# EAGLE design moduloSensores (EAGLE 7.6.0)
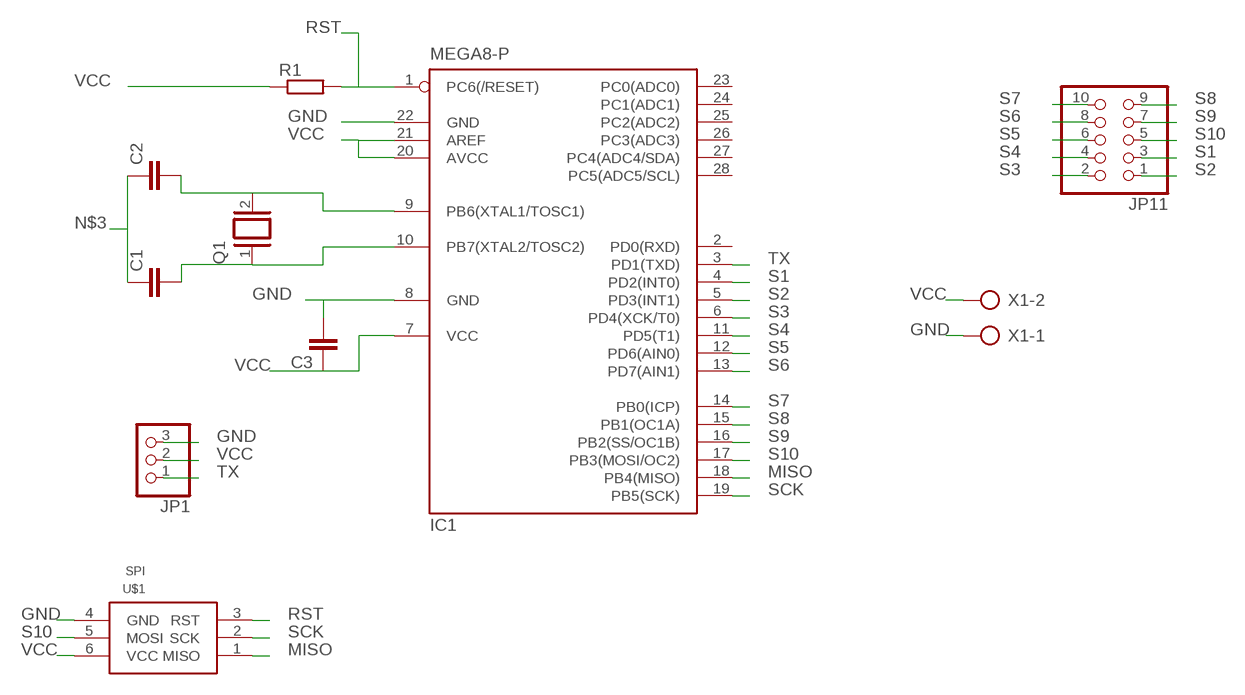
[diagram p0: schematic, sheet 1]

## Parts
C1  C-EU050-025X075  [C050-025X075]
C2  C-EU050-025X075  [C050-025X075]
C3  C-EU050-025X075  [C050-025X075]
IC1  MEGA8-P  [DIL28-3]
JP1  PINHD-1X3  [1X03]
JP11  PINHD-2X5  [2X05]
Q1  XTAL/S  [QS]
R1  R-EU_0204/7  [0204/7]
U$1  SPI  [HEAD-2X3]
X1  AK500/2  [AK500/2]

## Nets
GND: C3.2 IC1.8(GND) IC1.22(GND) JP1.3 U$1.4(GND) X1.1
MISO: IC1.18(PB4(MISO)) U$1.1(MISO)
N$1: C2.2 IC1.9(PB6(XTAL1/TOSC1)) Q1.2
N$2: C1.2 IC1.10(PB7(XTAL2/TOSC2)) Q1.1
N$3: C1.1 C2.1
RST: IC1.1(PC6(/RESET)) R1.2 U$1.3(RST)
S1: IC1.4(PD2(INT0)) JP11.3
S2: IC1.5(PD3(INT1)) JP11.1
S3: IC1.6(PD4(XCK/T0)) JP11.2
S4: IC1.11(PD5(T1)) JP11.4
S5: IC1.12(PD6(AIN0)) JP11.6
S6: IC1.13(PD7(AIN1)) JP11.8
S7: IC1.14(PB0(ICP)) JP11.10
S8: IC1.15(PB1(OC1A)) JP11.9
S9: IC1.16(PB2(SS/OC1B)) JP11.7
S10: IC1.17(PB3(MOSI/OC2)) JP11.5 U$1.5(MOSI)
SCK: IC1.19(PB5(SCK)) U$1.2(SCK)
TX: IC1.3(PD1(TXD)) JP1.1
VCC: C3.1 IC1.7(VCC) IC1.20(AVCC) IC1.21(AREF) JP1.2 R1.1 U$1.6(VCC) X1.2
Unconnected: IC1.2(PD0(RXD)) IC1.23(PC0(ADC0)) IC1.24(PC1(ADC1)) IC1.25(PC2(ADC2)) IC1.26(PC3(ADC3)) IC1.27(PC4(ADC4/SDA)) IC1.28(PC5(ADC5/SCL))

## Library data of the parts
C1-C3 = rcl:C-EU: CAPACITOR, European symbol
IC1 = atmel:MEGA8-P: MICROCONTROLLER 8 Kbytes FLASH, 1 kbytes SRAM, 512 bytes EEPROM, USART, 4-channel 10 bit ADC, 2-channel 8 bit ADC Pin compatible with Atmega48, ATMega88, ATMega168 Source: avr.lbr; OC_FARNELL: unknown; OC_NEWARK: unknown
JP1 = pinhead:PINHD-1X3: PIN HEADER
JP11 = pinhead:PINHD-2X5: PIN HEADER
Q1 = special:XTAL/S: CRYSTAL
R1 = rcl:R-EU_: RESISTOR, European symbol
U$1 = spi:SPI
X1 = con-ptr500:AK500/2: CONNECTOR; OC_FARNELL: unknown; OC_NEWARK: unknown

## Board
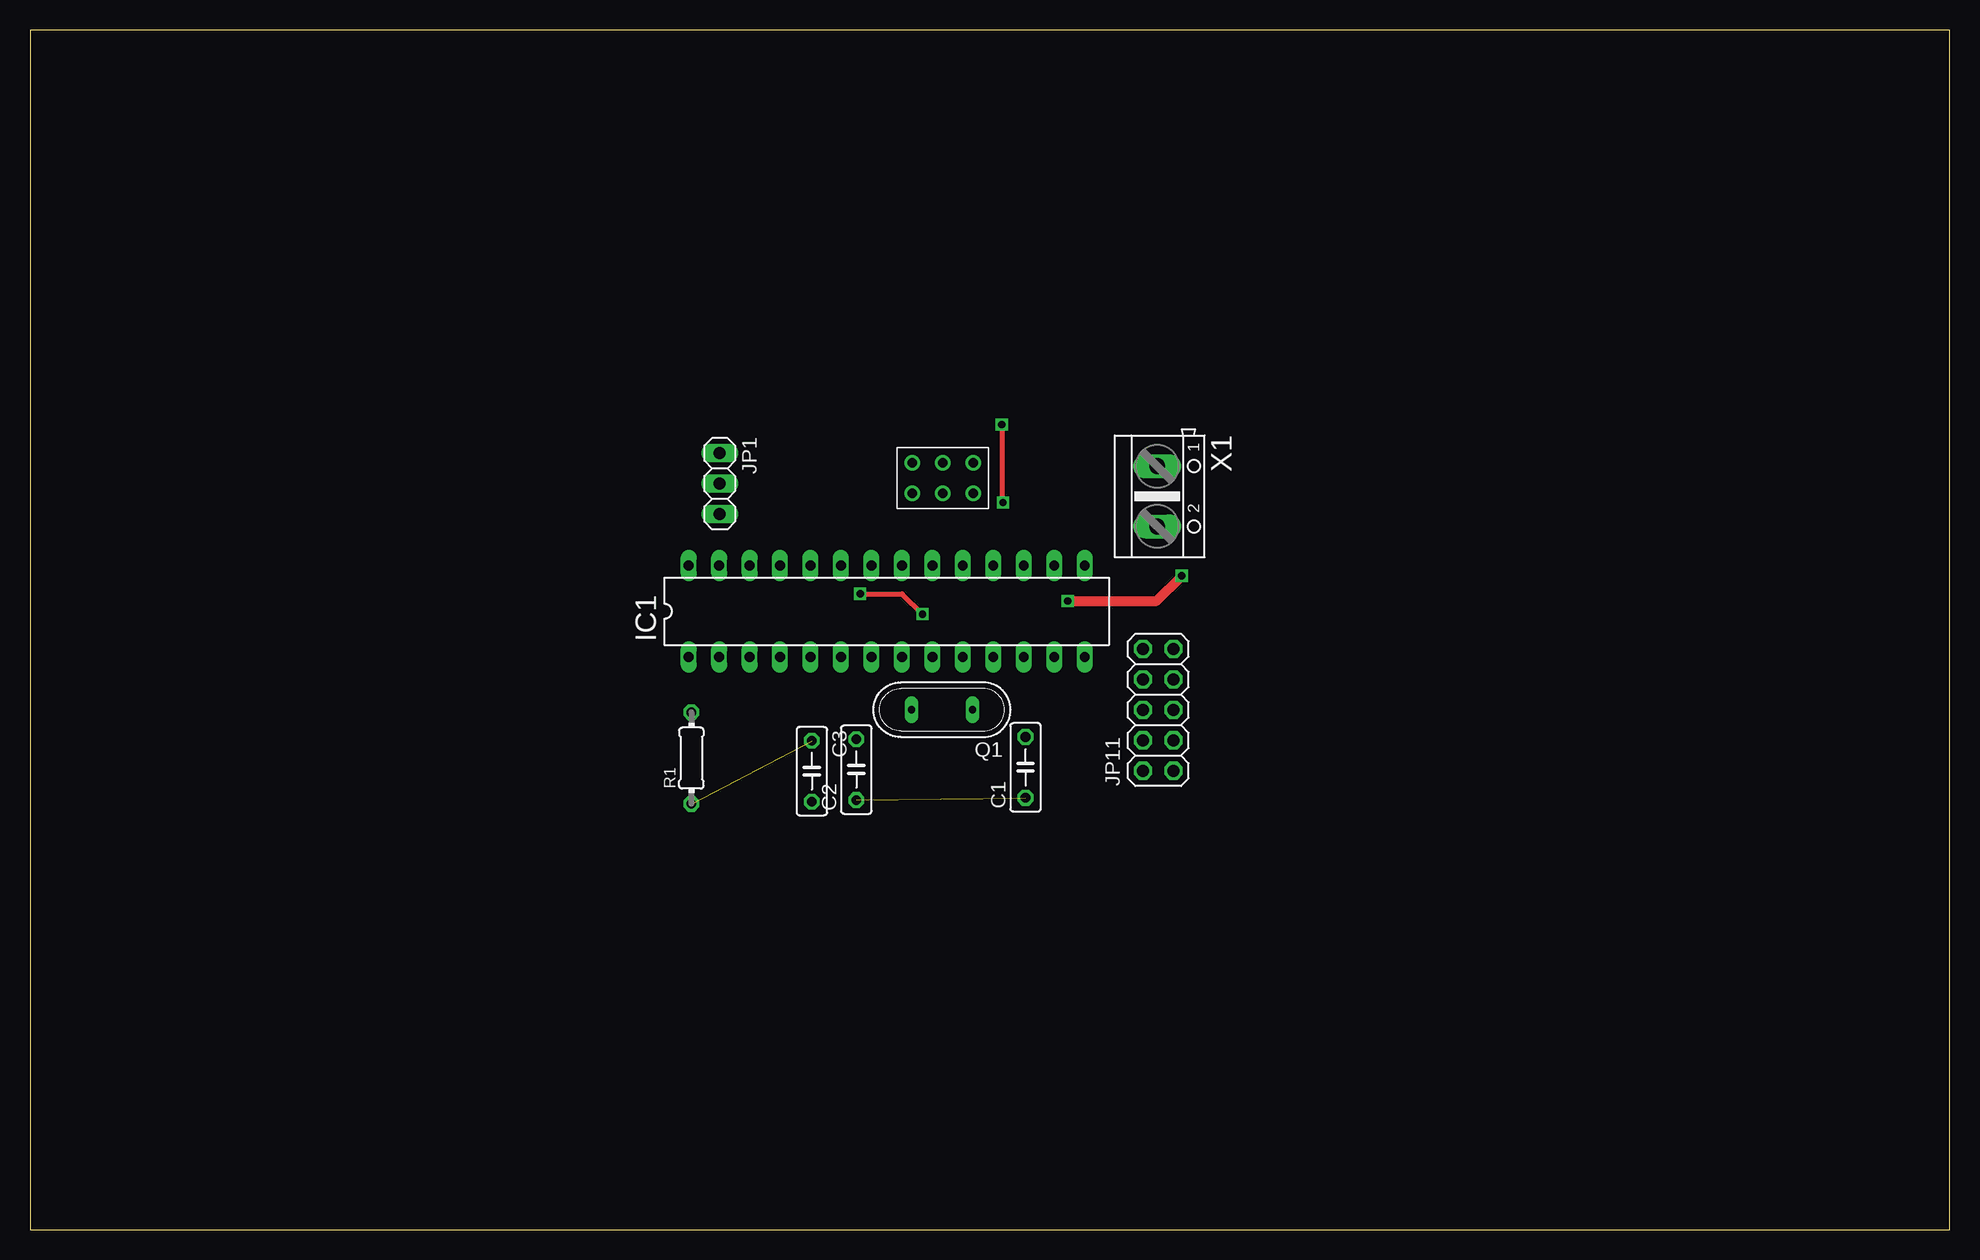
[diagram p1: board, top side]
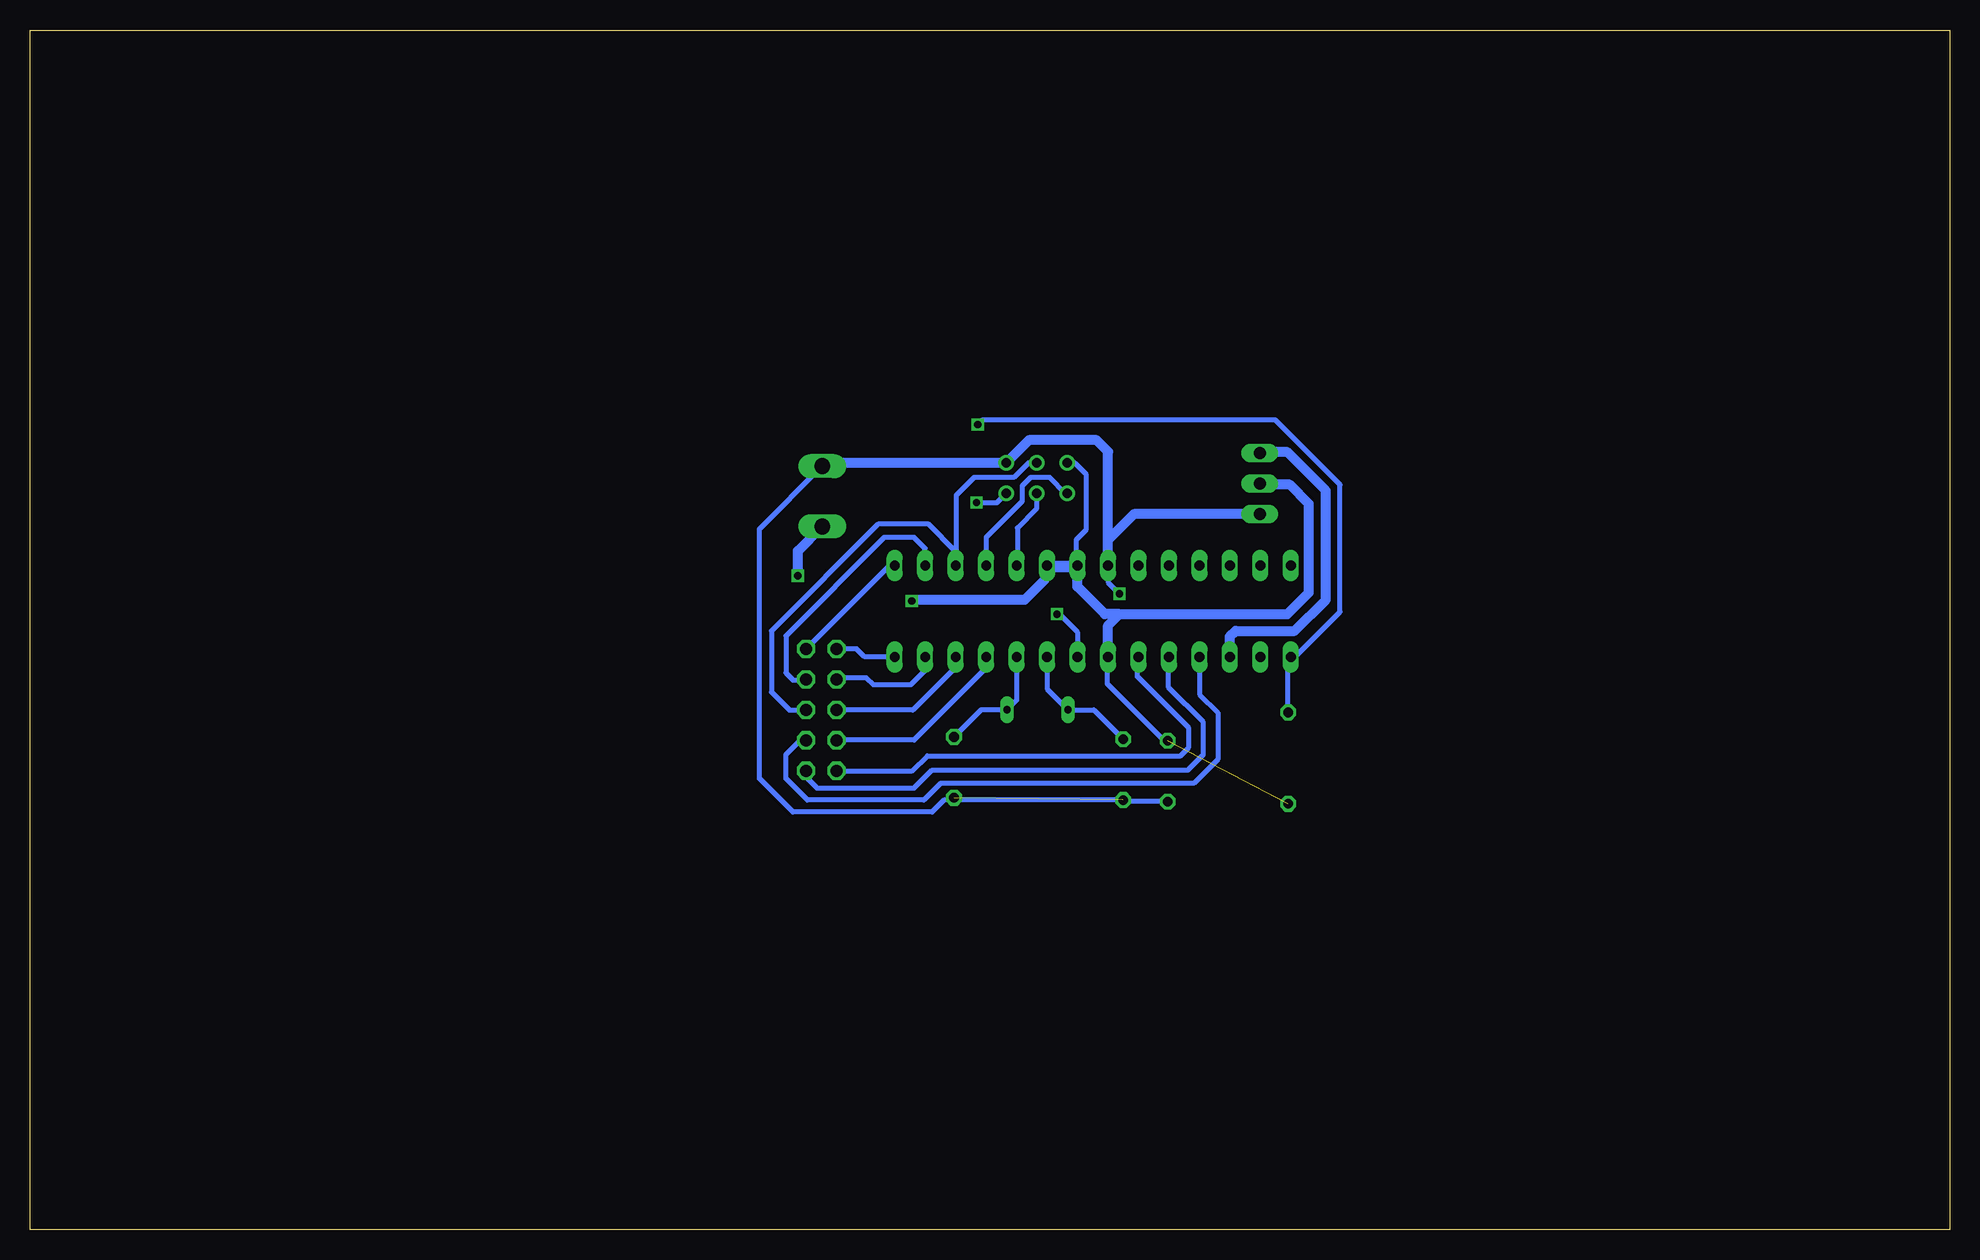
[diagram p2: board, bottom side, seen from below]

Size 160 x 100 mm. Coordinates in mm from the lower left corner, seen from the top.
Outline: 0,0 160,0 160,100 0,100 0,0
Copper layers (1*16): Top 0.035mm / dielectric 1.5mm / Bottom 0.035mm
Design rules "default": minimum track width 10mil, minimum drill 24mil, track to track 8mil, track to pad 8mil, pad to pad 8mil, via to via 8mil, smd to smd 8mil, copper to edge 40mil, drill to drill 8mil, minimum pad ring 10mil, minimum via ring 8mil, stop-mask expansion 4mil, vias tented up to drill 0mil, thermal gap 10mil

### Footprints (pad centres in the part's own frame; a part is rotated, then mirrored left to right if it is on the bottom)
C050-025X075 = drill 0.813 octagon: 1 -2.54,0; 2 2.54,0
DIL28-3 = drill 0.813 long: 1 -16.51,-3.81; 2 -13.97,-3.81; 3 -11.43,-3.81; 4 -8.89,-3.81; 5 -6.35,-3.81; 6 -3.81,-3.81; 7 -1.27,-3.81; 8 1.27,-3.81; 9 3.81,-3.81; 10 6.35,-3.81; 11 8.89,-3.81; 12 11.43,-3.81; 13 13.97,-3.81; 14 16.51,-3.81; 15 16.51,3.81; 16 13.97,3.81; 17 11.43,3.81; 18 8.89,3.81; 19 6.35,3.81; 20 3.81,3.81; 21 1.27,3.81; 22 -1.27,3.81; 23 -3.81,3.81; 24 -6.35,3.81; 25 -8.89,3.81; 26 -11.43,3.81; 27 -13.97,3.81; 28 -16.51,3.81
1X03 = drill 1.016 long: 1 -2.54,0; 2 0,0; 3 2.54,0
2X05 = drill 1.016 octagon: 1 -5.08,-1.27; 2 -5.08,1.27; 3 -2.54,-1.27; 4 -2.54,1.27; 5 0,-1.27; 6 0,1.27; 7 2.54,-1.27; 8 2.54,1.27; 9 5.08,-1.27; 10 5.08,1.27
QS = drill 0.61 long: 1 -2.54,0; 2 2.54,0
0204/7 = drill 0.813 octagon: 1 -3.81,0; 2 3.81,0
HEAD-2X3 = drill 0.8: 1 -2.54,-1.27; 2 0,-1.27; 3 2.54,-1.27; 4 2.54,1.27; 5 0,1.27; 6 -2.54,1.27
AK500/2 = drill 1.321 long: 1 -2.515,0; 2 2.515,0

### Placement (x,y rotation side)
C1  82.98,38.53 90 top
C2  68.88,38.34 90 top
C3  65.17,38.21 270 top
IC1  71.41,51.54 0 top
JP1  57.49,62.18 270 top
JP11  94.04,43.32 90 top
Q1  76.02,43.33 180 top
R1  55.13,39.3 90 top
U$1  76.09,62.64 0 top
X1  93.96,61.12 270 top

### Tracks (layer width: path | path; a pad name or v marks a point on that pad's centre or on a via)
GND  (via drill 0.6)
  Top 0.406: v69.2,53 72.7,53 v74.4,51.3
  Bottom 0.406: C3.2 69.27,35.67 69.4,35.8 83.8,35.8 84.8,34.8 96.4,34.8 99.2,37.6 99.2,58.4 X1.1 | IC1.22 70.14,53.94 v69.2,53 | v74.4,51.3 74.2,51.3 72.7,49.8 72.7,47.75 IC1.8
  Bottom 0.813: IC1.22 70.14,57.5 | 70.14,57.5 70.14,64.84 71.1,65.8 76.74,65.8 U$1.4 93.69,63.91 X1.1 | JP1.3 68,59.64 70.14,57.5
MISO
  Bottom 0.406: U$1.1 73.67,61.37 75,62.7 76.6,62.7 77.3,62 77.3,60.7 80.3,57.7 IC1.18
N$1
  Bottom 0.406: IC1.9 75.22,45.07 Q1.2 71.33,43.33 C2.2
N$2
  Bottom 0.406: IC1.10 77.76,44.13 Q1.1 80.72,43.33 C1.2
N$3  (1 unrouted)
RST  (via drill 0.6)
  Top 0.406: v81,67.1 81,60.7 v81.1,60.6
  Bottom 0.406: R1.2 55.13,47.5 IC1.1 54.57,47.73 50.8,51.5 50.8,62.1 56.2,67.5 80.6,67.5 v81,67.1 | v81.1,60.6 79.4,60.6 U$1.3
S1
  Bottom 0.406: IC1.4 62.52,44.62 61,43.1 61,39.2 63,37.2 84.1,37.2 85.5,35.8 95.2,35.8 97,37.6 97,39.6 95.9,40.7 95.39,40.7 JP11.3
S2
  Bottom 0.406: JP11.1 95.31,37.71 94.4,36.8 86.3,36.8 84.8,38.3 63.5,38.3 62.2,39.6 62.2,42.3 65.1,45.2 65.1,47.69 IC1.5
S3
  Bottom 0.406: JP11.2 86.46,38.24 85.2,39.5 64.1,39.5 63.4,40.2 63.4,41.8 67.7,46.1 67.7,47.63 IC1.6
S4
  Bottom 0.406: IC1.11 80.3,46.8 86.3,40.8 92.75,40.8 JP11.4
S5
  Bottom 0.406: IC1.12 82.84,46.86 86.4,43.3 92.75,43.3 JP11.6
S6
  Bottom 0.406: IC1.13 85.38,46.62 86.6,45.4 89.7,45.4 90.3,46 92.63,46 JP11.8
S7
  Bottom 0.406: IC1.14 90.43,47.73 91.1,48.4 JP11.10
S8
  Bottom 0.406: IC1.15 88.36,55.35 JP11.9
S9
  Bottom 0.406: IC1.16 85.38,56.78 86.3,57.7 88.8,57.7 97,49.5 97,46.4 96.4,45.8 95.37,45.8 JP11.7
S10
  Bottom 0.406: U$1.5 76.79,63.91 78,62.7 81.3,62.7 82.8,61.2 82.8,55.39 IC1.17 82.84,56.54 85.1,58.8 89.3,58.8 98.2,49.9 98.2,44.8 96.7,43.3 95.33,43.3 JP11.5
SCK
  Bottom 0.406: U$1.2 76.09,60.11 77.7,58.5 77.7,55.41 IC1.19
TX
  Bottom 0.813: IC1.3 59.98,49.42 59.5,49.9 54.6,49.9 52,52.5 52,61.6 55.2,64.8 57.41,64.8 JP1.1
VCC  (via drill 0.6)  (1 unrouted)
  Top 0.813: v86.5,52.4 93.9,52.4 v96,54.5
  Bottom 0.406: C3.1 65.45,40.75 70.2,45.5 70.2,47.67 IC1.7 | U$1.6 72.91,63.91 72,63 72,58.3 72.8,57.5 72.8,55.47 IC1.21 IC1.20
  Bottom 0.813: 69.2,51.3 70.4,51.3 72.7,53.6 72.7,55.2 | 72.7,55.2 72.7,55.33 IC1.21 | IC1.7 70.14,50.36 69.2,51.3 | 69.2,51.3 55.2,51.3 53.4,53.1 53.4,60.5 55,62.1 57.41,62.1 JP1.2 | IC1.20 72.85,55.35 72.7,55.2 | 72.7,55.2 75.3,55.2 75.4,55.3 75.4,54.2 77.1,52.5 86.4,52.5 v86.5,52.4 | v96,54.5 96,56.56 X1.2